# Altium project PCB_Project.PrjPcb
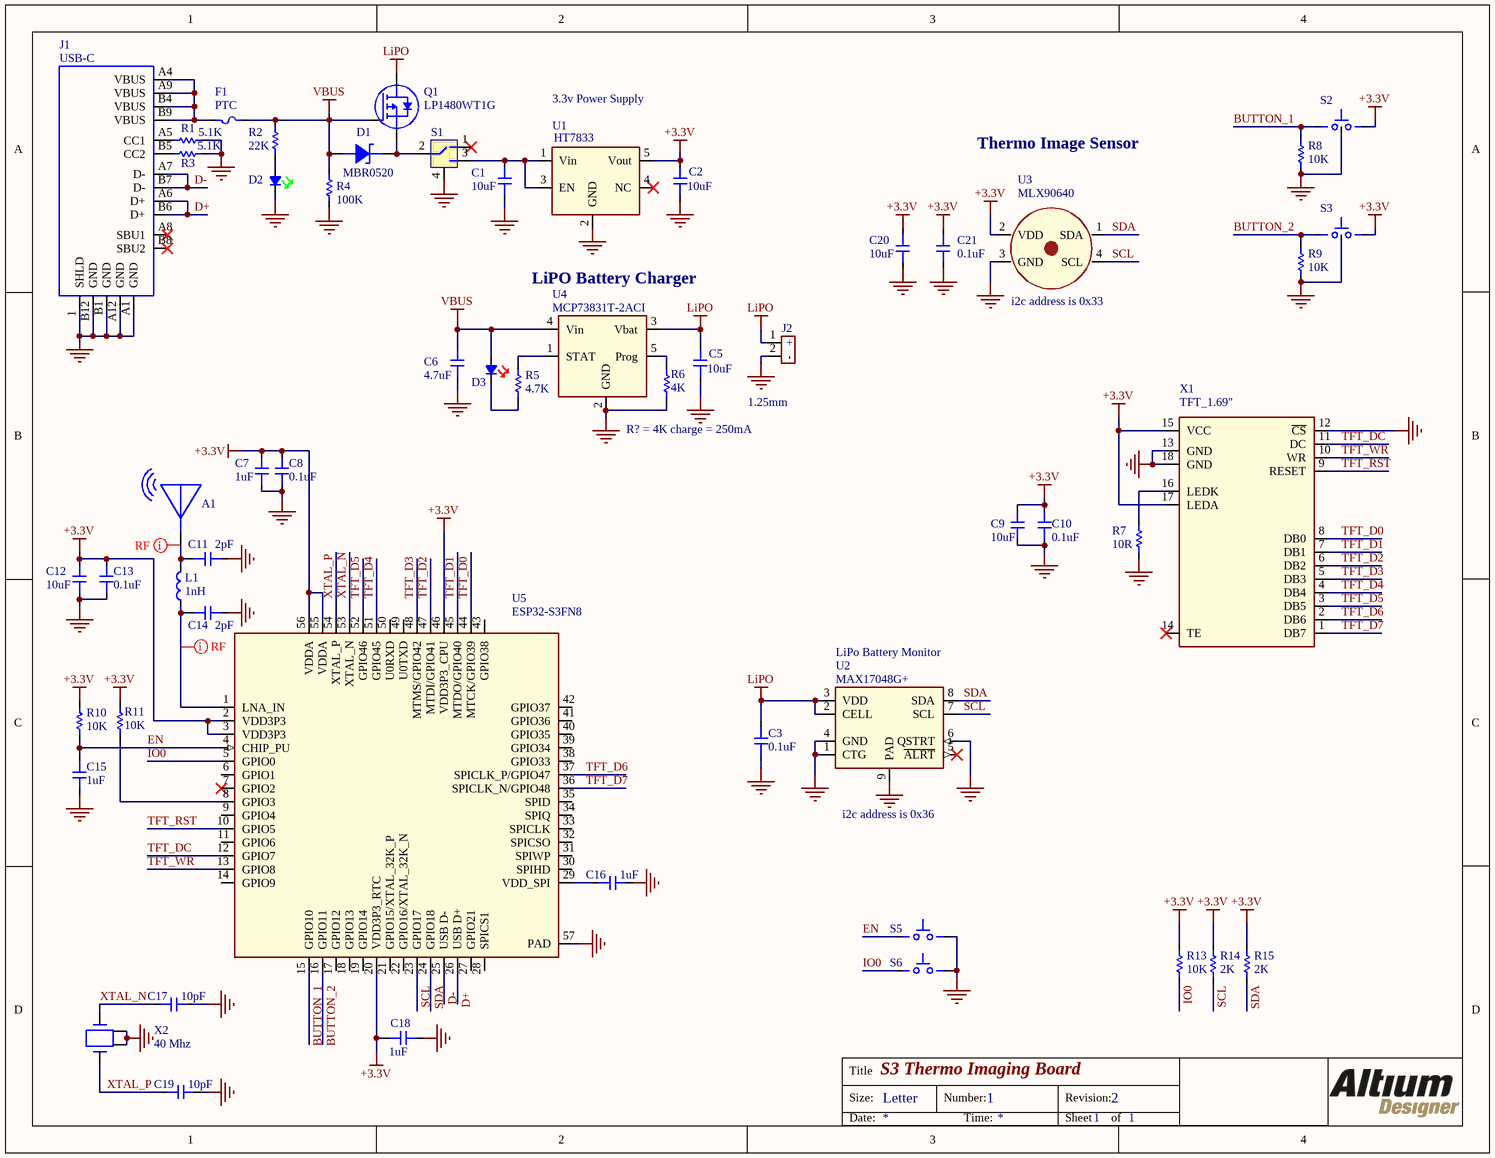
[diagram p0: Schematic_Rev2.SchDoc]
1 sheet, 55 parts. Net scope: global (net labels, ports and power ports of the same name join across sheets).
Board file: PCB_Rev2.PcbDoc

## Sheet Schematic_Rev2.SchDoc: S3 Thermo Imaging Board
size Letter; DrawnBy: x; Engineer: x; DocumentNumber: 1; Revision: 2; SheetNumber: 1; SheetTotal: 1; ImagePath: x

### Parts
A1  ANT3216LL00R2400A  [ANT3216LL00R2400A]  (value not drawn)
C1  10uF  [CAPC2012X140N]
C2  10uF  [CAPC2012X140N]
C3  0.1uF  [CAPC1005X56N]
C5  10uF  [CAPC2012X140N]
C6  4.7uF  [CAPC2012X140N]
C7  1uF  [CAPC1608X09L]
C8  0.1uF  [CAPC1608X09L]
C9  10uF  [CAPC2012X140N]
C10  0.1uF  [CAPC1608X09L]
C11  2pF  [CAPC1005X56N]
C12  10uF  [CAPC2012X140N]
C13  0.1uF  [CAPC1005X56N]
C14  2pF  [CAPC1005X56N]
C15  1uF  [CAPC1005X56N]
C16  1uF  [CAPC1005X56N]
C17  10pF  [CAPC1005X56N]
C18  1uF  [CAPC1608X09L]
C19  10pF  [CAPC1005X56N]
C20  10uF  [CAPC2012X140N]
C21  0.1uF  [CAPC1608X09L]
D1  value MBR0520  [SOD123]  (hidden comment: MBR0520-TP)
D2  Green Led  [LED1005X40N-Green]  (value not drawn)
D3  Red Led  [LED1005X40N-Red]  (value not drawn)
F1  PTC  [RESC1608X06L (0603 FOOTPRINT)]
J1  USB-C  [TYPE-C-31-M-12]
J2  1.5mm  [0530470260]  (value not drawn)
L1  1nH  [INDC1005X40L]
Q1  LP1480WT1G  [SC-70]
R1  5.1K  [RESC1005X40L (0402 FOOTPRINT)]
R2  22K  [RESC1005X40L (0402 FOOTPRINT)]
R3  5.1K  [RESC1005X40L (0402 FOOTPRINT)]
R4  100K  [RESC1005X40L (0402 FOOTPRINT)]
R5  4.7K  [RESC1005X40L (0402 FOOTPRINT)]
R6  4K  [RESC1005X40L (0402 FOOTPRINT)]
R7  10R  [RESC1005X40L (0402 FOOTPRINT)]
R8  10K  [RESC1005X40L (0402 FOOTPRINT)]
R9  10K  [RESC1005X40L (0402 FOOTPRINT)]
R10  10K  [RESC1005X40L (0402 FOOTPRINT)]
R11  10K  [RESC1005X40L (0402 FOOTPRINT)]
R13  10K  [RESC1005X40L (0402 FOOTPRINT)]
R14  2K  [RESC1005X40L (0402 FOOTPRINT)]
R15  2K  [RESC1005X40L (0402 FOOTPRINT)]
S1  SWITCH SLIDE  [K3-1296S-E1]  (value not drawn)
S2  Push  [1TS003B-1600-3500A-CT]  (value not drawn)
S3  Push  [1TS003B-1600-3500A-CT]  (value not drawn)
S5  (no value)  [TL1015AF160QG]
S6  (no value)  [TL1015AF160QG]
U1  HT7833  [SOT95P280X144-5N]
U2  MAX17048G+  [DFN-8_Smaller]
U3  value MLX90640  [MLX90640ESF]  (hidden comment: MLX90640ESF-BAB-000-TU)
U4  value MCP73831T-2ACI  [SOT95P280X144-5N]  (hidden comment: MCP73831T-2ACI/OT)
U5  ESP32-S3FN8  [QFN56_0.4mm pitch - Rev2]
X1  TFT_1.69"  [TFT_GLASS 1.69 INCH 8-BIT]
X2  40 Mhz  [OSC20X16]

### Nets
+3.3V: C2.1 C7.1 C8.1 C9.1 C10.1 C12.1 C13.1 C18.2 C20.1 C21.1 R10.2 R11.1 R13.1 R14.1 R15.1 S2.2(B) S3.2(B) U1.5(Vout) U3.2(VDD) U5.2(VDD3P3) U5.3(VDD3P3) U5.20(VDD3P3_RTC) U5.46(VDD3P3_CPU) U5.55(VDDA) U5.56(VDDA) X1.15(VCC) X1.17(LEDA)
GND: C1.2 C2.2 C3.2 C5.2 C6.2 C7.2 C8.2 C9.2 C10.2 C11.2 C12.2 C13.2 C14.2 C15.2 C16.2 C17.2 C18.1 C19.2 C20.2 C21.2 D2.1 J1.1(SHLD) J1.A1(GND) J1.A12(GND) J1.B1(GND) J1.B12(GND) J2.2 R1.1 R3.1 R4.2 R6.1 R7.2 R8.1 R9.1 S1.4 S2.3 S3.3 S5.2(B) S6.2(B) U1.2(GND) U2.1(CTG) U2.4(GND) U2.6(QSTRT) U2.9(PAD) U3.3(GND) U4.2(GND) U5.57(PAD) X1.12(~{CS}) X1.13(GND) X1.18(GND) X2.2 X2.4
LiPO: C3.1 C5.1 J2.1 Q1.3(D) U2.2(CELL) U2.3(VDD) U4.3(Vbat)
VBUS: C6.1 D1.2(Annode) D3.2 F1.1 Q1.1(G) R2.2 R4.1 U4.4(Vin)
BUTTON_1: R8.2 S2.1(A) U5.15(GPIO10)
BUTTON_2: R9.2 S3.1(A) U5.16(GPIO11)
D+: J1.A6(D+) J1.B6(D+) U5.26(USB_D+)
D-: J1.A7(D-) J1.B7(D-) U5.25(USB_D-)
EN: C15.1 R10.1 S5.1(A) U5.4(CHIP_PU)
IO0: R13.2 S6.1(A) U5.5(GPIO0)
SCL: R14.2 U2.7(SCL) U3.4(SCL) U5.23(GPIO17)
SDA: R15.2 U2.8(SDA) U3.1(SDA) U5.24(GPIO18)
TFT_D0: U5.44(MTCK/GPIO39) X1.8(DB0)
TFT_D1: U5.45(MTDO/GPIO40) X1.7(DB1)
TFT_D2: U5.47(MTDI/GPIO41) X1.6(DB2)
TFT_D3: U5.48(MTMS/GPIO42) X1.5(DB3)
TFT_D4: U5.51(GPIO45) X1.4(DB4)
TFT_D5: U5.52(GPIO46) X1.3(DB5)
TFT_D6: U5.37(SPICLK_P/GPIO47) X1.2(DB6)
TFT_D7: U5.36(SPICLK_N/GPIO48) X1.1(DB7)
TFT_DC: U5.12(GPIO7) X1.11(DC)
TFT_RST: U5.10(GPIO5) X1.9(RESET)
TFT_WR: U5.13(GPIO8) X1.10(WR)
XTAL_N: C17.1 U5.53(XTAL_N) X2.3
XTAL_P: C19.1 U5.54(XTAL_P) X2.1
NetA1_1: A1.1 C11.1 L1.1
NetC1_1: C1.1 S1.3 U1.1(Vin) U1.3(EN)
NetC14_1: C14.1 L1.2 U5.1(LNA_IN)
NetC16_1: C16.1 U5.29(VDD_SPI)
NetD1_1: D1.1(Cathode) Q1.2(S) S1.2
NetD2_2: D2.2 R2.1
NetD3_1: D3.1 R5.1
NetF1_2: F1.2 J1.A4(VBUS) J1.A9(VBUS) J1.B4(VBUS) J1.B9(VBUS)
NetJ1_A5: J1.A5(CC1) R1.2
NetJ1_B5: J1.B5(CC2) R3.2
NetR5_2: R5.2 U4.1(STAT)
NetR6_2: R6.2 U4.5(Prog)
NetR7_1: R7.1 X1.16(LEDK)
NetR11_2: R11.2 U5.8(GPIO3)

Not connected (* = marked no-connect by the designer): J1 A8(SBU1)* B8(SBU2)*; S1 1*; U1 4(NC)*; U2 5(~{ALRT})*; U5 6(GPIO1) 7(GPIO2)* 9(GPIO4) 11(GPIO6) 14(GPIO9) 17(GPIO12) 18(GPIO13) 19(GPIO14) 21(GPIO15/XTAL_32K_P) 22(GPIO16/XTAL_32K_N) 27(GPIO21) 28(SPICS1) 30(SPIHD) 31(SPIWP) 32(SPICSO) 33(SPICLK) 34(SPIQ) 35(SPID) 38(GPIO33) 39(GPIO34) 40(GPIO35) 41(GPIO36) 42(GPIO37) 43(GPIO38) 49(U0TXD) 50(U0RXD); X1 14(TE)*

### Layout directives
net class RF: NetA1_1, NetC14_1

### Notes on the sheet
- 3.3v Power Supply
- Thermo Image Sensor
- LiPO Battery Charger
- (near U3) i2c address is 0x33
- R? = 4K charge = 250mA
- 1.25mm
- (near U2) LiPo Battery Monitor
- (near U2) i2c address is 0x36
- Title
- Size:
- Letter
- Number:
- Revision:
- Date:
- Time:
- Sheet
- of
- (in symbol Molex_onn_2Pin_1.25mm_Vert) +; -

### Library data of the parts
A1 = ANT3216LL00R2400A: Antenna Chip 2.4Gig; Manufacturer: YAGEO; Vendor: LCSC; Value: Chip Antenna; Part_Number: ANT3216LL00R2400A
C1 C2 C5 C12 C20 = CAP_0805: CAP 10uF 50V 0805; Part_Footprint: 0805; Value: 10uF
C3 C13 = CAP_0402: CAP 0.1uF 0402; Part_Footprint: 0402; Value: 0.1uF
C6 = CAP_0805: CAP 4.7uF 0805; Part_Footprint: 0805; Value: 4.7uF
C7 C18 = CAP_0603: CAP 1uF 0603; Part_Footprint: 0603; Value: 1uF
C8 C10 C21 = CAP_0603: CAP 0.1uF 0603; Part_Footprint: 0603; Value: 0.1uF
C9 = CAP_0805: CAP 10uF 0805; Part_Footprint: 0805; Value: 10uF
C11 C14 = CAP_0402: CAP 2pF 0402; Part_Footprint: 0402; Value: 2pF
C15 C16 = CAP_0402: CAP 1uF 0402; Part_Footprint: 0402; Value: 1uF
C17 C19 = CAP_0402: CAP 10pF 0402; Part_Footprint: 0402; Value: 10pF
D1 = MBR0520-TP: DIODE SCHOTTKY 20V 500MA SOD-123; Manufacturer: Micro; Part_Number: C78746; Vendor: LCSC; Part_Footprint: SOD-123
D2 = LED_0402_SMALL_GREEN: LED Green 0402; Part_Number: C74338; Part_Footprint: 0402; Vendor: LCSC; Value: Green Led
D3 = LED_0402_SMALL_Red: LED Red 0402; Part_Number: C364556; Manufacturer: Lite-On; Part_Footprint: 0402; Vendor: LCSC; Value: Red Led
F1 = PTC_FUSE_0603: PTC FUSE 0.5mA hold, 1A trip 0603; Manufacturer: JDT Fuse; Part_Number: C2982257; Vendor: LCSC; Value: PTC
J1 = USB-C: CONN RECPT USB-C; Manufacturer: KHE; Part_Number: C165948; Part_Footprint: SMT; Vendor: LCSC; Value: USB-C
J2 = Molex_onn_2Pin_1.25mm_Vert: MIcro Conn 2POS 1.25mm Pitch Vertical; Manufacturer: Molex; Vendor: Digi-Key; Value: 0530470260; Part_Number: 0530470260
L1 = Inductor: Inductor 1nH 0402; Value: 1nH; Part_Footprint: *
Q1 = LP1480WT1G: MOSFET P-CH 20V 1.4A SC-70; Manufacturer: LRC; Part_Number: C172434; Vendor: LCSC; Part_Footprint: SC-70; Value: LP1480WT1G
R1 R3 = RES_0402: RES 5.1K 0402; Part_Footprint: 0402; Value: 5.1K
R2 = RES_0402: RES 22K 0402; Part_Footprint: 0402; Value: 22K
R4 = RES_0402: RES 100K 0402; Part_Footprint: 0402; Value: 100K
R5 = RES_0402: RES 4.7K 0402; Part_Footprint: 0402; Value: 4.7K
R6 = RES_0402: RES 4K 0402; Part_Footprint: 0402; Value: 4K
R7 = RES_0402: RES 10R 0402; Part_Footprint: 0402; Value: 10R
R8-R11 R13 = RES_0402: RES 10K 0402; Part_Footprint: 0402; Value: 10K
R14 R15 = RES_0402: RES 2K 0402; Part_Footprint: 0402; Value: 2K
S1 = K3-1296S-E1: SWITCH SLIDE SMD; Manufacturer: Korean Hroparts Elec; Vendor: LCSC; Part_Number: K3-1296S-E1; Value: SWITCH SLIDE; Part_Footprint: *
S2 S3 = SWITCH TACTILE R/A_MICRO: SWITCH TACTILE R/A MICRO; Part_Number: C255808; Manufacturer: HYP; Value: Switch R/A Micro; Vendor: LCSC
S5 S6 = TL1015AF160QG: SWITCH MOMENTARY; Part_Footprint: SMD; Vendor: Digi-Key; Part_Number: TL1015AF160QG
U1 = HT7833: IC LDO 3.3V 0.5A SOT23-5; Manufacturer: Holtek; Part_Number: C164106; Vendor: LCSC; Value: HT7833; Part_Footprint: SOT23-5
U2 = MAX17048G+: IC BATT MON LI-ION 1CELL 8TDFN; Manufacturer: Analog Devices; Vendor: Digi-Key; Part_Number: MAX17048G+
U3 = MLX90640ESF-BAB-000-TU: Thermal Image Sensor TO-39; Manufacturer: Melexis; Vendor: Digi-Key; Part_Footprint: TO-39; Part_Number: MLX90640ESF-BAB-000-TU
U4 = MCP73831T-2ACI/OT: Charger IC Lithium-Ion/Polymer SOT23-5; Manufacturer: Microchip; Vendor: Digi-Key; Part_Number: MCP73831T-2ACI/OT
U5 = ESP32-S3: WIFI/Bluetooth, 8M PSRAM, QFN-56 7x7; Manufacturer: Espressif; Part_Footprint: QFN56; Part_Number: ESP32-S3FN8; Value: ESP32-S3FN8
X1 = TFT_GLASS 1.69 INCH COLOR 8-BIT: 1.69 INCH TFT 8-BIT PARALLEL BUS; Part_Number: ER-TFT1.69-1; Manufacturer: BuyDisplay; Vendor: BuyDisplay; Value: TFT_1.69"
X2 = 40Mhz: CRYSTAL 40MHZ 10PF SMD; Part_Number: ECS-400-10-37B2-CKM; Manufacturer: ECS; Vendor: Digi-Key; Value: 40 Mhz